# Altium schematic sheet Sheet_EPM7064SLC44.SCHDOC
size A4
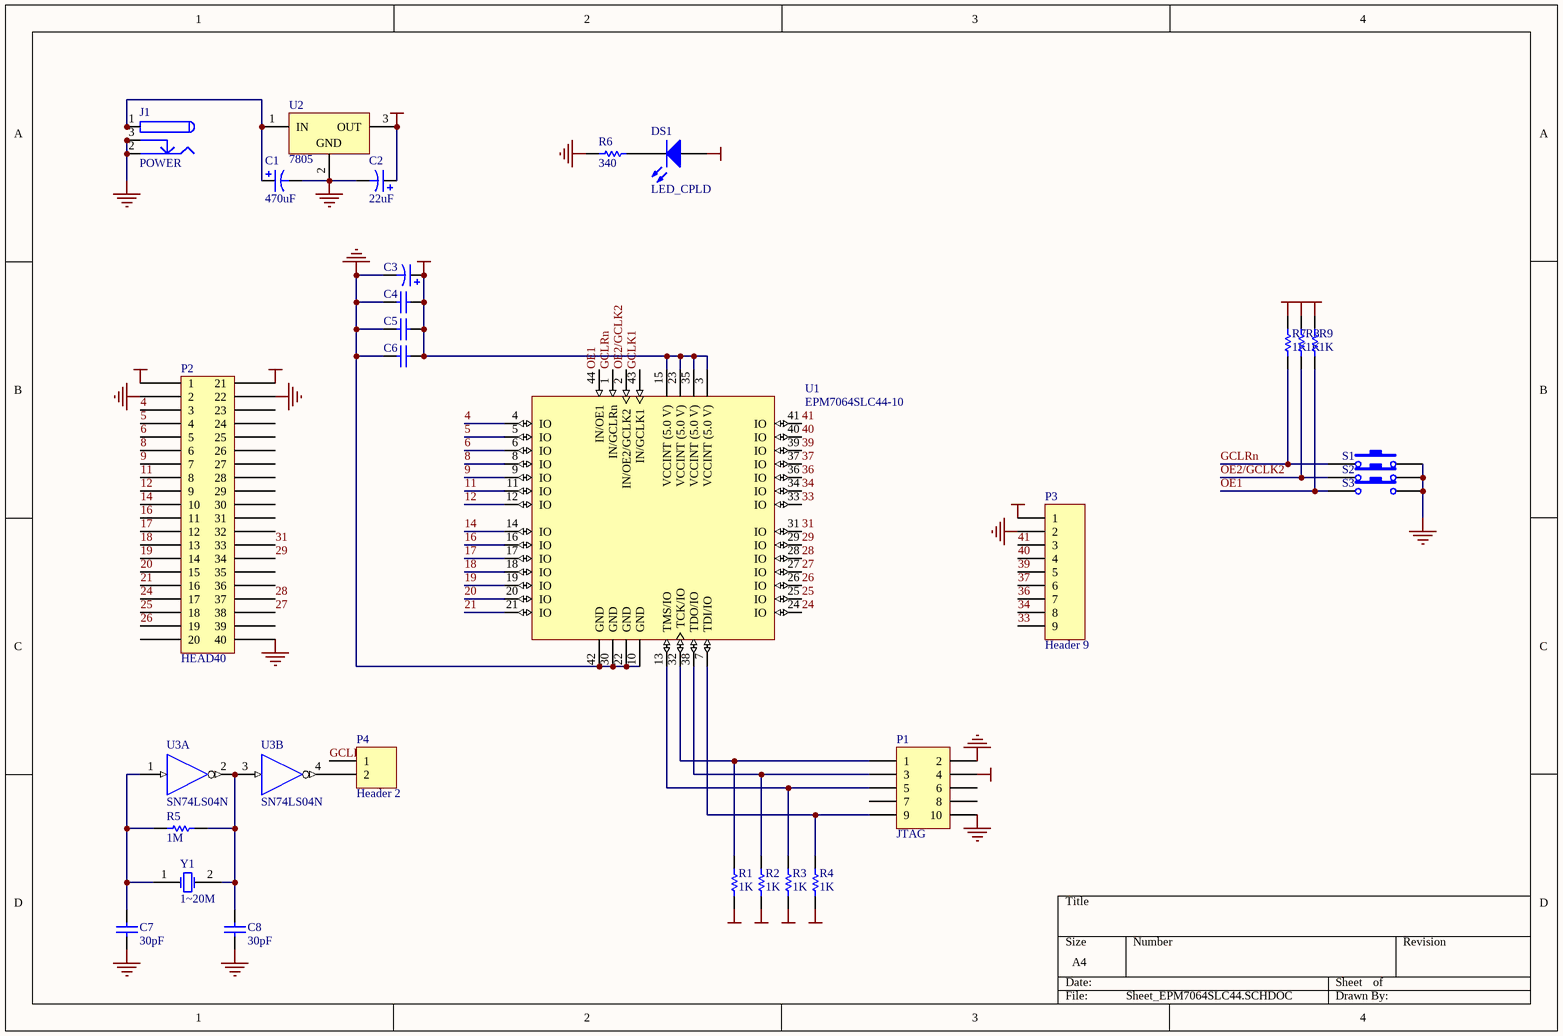
[diagram p0: Sheet_EPM7064SLC44.SCHDOC]

## Parts
C1  470uF  [CAPPR2-5x6.8]
C2  22uF  [CAPPR1.5-4x5]
C3  10uF  [CAPPR1.5-4x5]  (value not drawn)
C4  0.1uF  [CAPR2.54-5.1x3.2]  (value not drawn)
C5  0.1uF  [CAPR2.54-5.1x3.2]  (value not drawn)
C6  0.1uF  [CAPR2.54-5.1x3.2]  (value not drawn)
C7  30pF  [CAPR2.54-5.1x3.2]
C8  30pF  [CAPR2.54-5.1x3.2]
DS1  LED_CPLD  [LED]
J1  POWER  [KLD-0202]
P1  JTAG  [HEADER-5X2POL]
P2  HEAD40  [DBZ2]
P3  Header 9  [HDR1X9]
P4  Header 2  [HDR1X2]
R1  1K  [AXIAL-0.3]
R2  1K  [AXIAL-0.3]
R3  1K  [AXIAL-0.3]
R4  1K  [AXIAL-0.3]
R5  1M  [AXIAL-0.3]
R6  340  [AXIAL-0.3]
R7  1K  [AXIAL-0.3]
R8  1K  [AXIAL-0.3]
R9  1K  [AXIAL-0.3]
S1  SW-PB  [SPST-2]  (value not drawn)
S2  SW-PB  [SPST-2]  (value not drawn)
S3  SW-PB  [SPST-2]  (value not drawn)
U1  EPM7064SLC44-10  [PLCC_44]
U2  7805  [KC03]
U3  SN74LS04N  [N014]  (parts A,B of 6)
Y1  1~20M  [XT2]

## Nets
GND: C1.2 C2.2 C3.2 C4.1 C5.1 C6.1 C7.1 C8.1 J1.2 J1.2A J1.2B J1.3 J1.3A J1.3B P1.2 P1.10 P2.2 P2.22 P2.40 P3.2 R6.2 S1.2 S2.2 S3.2 U1.10(GND) U1.22(GND) U1.30(GND) U1.42(GND) U2.2(GND) U3.7(GND)
VCC: C2.1 C3.1 C4.2 C5.2 C6.2 DS1.1(A) P1.4 P2.1 P2.21 P3.1 R1.1 R2.1 R3.1 R4.1 R7.2 R8.2 R9.2 U1.3(VCCINT_(5.0_V)) U1.15(VCCINT_(5.0_V)) U1.23(VCCINT_(5.0_V)) U1.35(VCCINT_(5.0_V)) U2.3(OUT) U3.14(VCC)
4: P2.3 U1.4(IO)
5: P2.4 U1.5(IO)
6: P2.5 U1.6(IO)
8: P2.6 U1.8(IO)
9: P2.7 U1.9(IO)
11: P2.8 U1.11(IO)
12: P2.9 U1.12(IO)
14: P2.10 U1.14(IO)
16: P2.11 U1.16(IO)
17: P2.12 U1.17(IO)
18: P2.13 U1.18(IO)
19: P2.14 U1.19(IO)
20: P2.15 U1.20(IO)
21: P2.16 U1.21(IO)
24: P2.17 U1.24(IO)
25: P2.18 U1.25(IO)
26: P2.19 U1.26(IO)
27: P2.38 U1.27(IO)
28: P2.37 U1.28(IO)
29: P2.34 U1.29(IO)
31: P2.33 U1.31(IO)
33: P3.9 U1.33(IO)
34: P3.8 U1.34(IO)
36: P3.7 U1.36(IO)
37: P3.6 U1.37(IO)
39: P3.5 U1.39(IO)
40: P3.4 U1.40(IO)
41: P3.3 U1.41(IO)
GCLK1: P4.1 U1.43(IN/GCLK1)
GCLRn: R7.1 S1.1 U1.1(IN/GCLRn)
OE1: R9.1 S3.1 U1.44(IN/OE1)
OE2/GCLK2: R8.1 S2.1 U1.2(IN/OE2/GCLK2)
NetC1_1: C1.1 J1.1 J1.1A J1.1B U2.1(IN)
NetC7_2: C7.2 R5.1 U3.1(A) Y1.1(OSC1)
NetC8_2: C8.2 R5.2 U3.2(Y) U3.3(A) Y1.2(OSC2)
NetDS1_2: DS1.2(K) R6.1
NetP1_1: P1.1 R1.2 U1.32(TCK/IO)
NetP1_3: P1.3 R2.2 U1.38(TDO/IO)
NetP1_5: P1.5 R3.2 U1.13(TMS/IO)
NetP1_9: P1.9 R4.2 U1.7(TDI/IO)
NetP4_2: P4.2 U3.4(Y)

Not connected (* = marked no-connect by the designer): P1 6 7 8; P2 20 23 24 25 26 27 28 29 30 31 32 35 36 39

## Library data of the parts
C1-C3 = Cap Pol1: Polarized Capacitor (Radial); Published: 8-Jun-2000; LatestRevisionDate: 17-Jul-2002; LatestRevisionNote: Re-released for DXP Platform.; Publisher: Altium Limited
  C1: Value: 470uF
  C2: Value: 22uF
  C3: Value: 10uF
C4-C8 = Cap: Capacitor; Published: 8-Jun-2000; LatestRevisionDate: 17-Jul-2002; LatestRevisionNote: Re-released for DXP Platform.; Publisher: Altium Limited
  C4-C6: Value: 0.1uF
  C7 C8: Value: 30pF
DS1 = LED0: Typical INFRARED GaAs LED; Published: 8-Jun-2000; LatestRevisionDate: 17-Jul-2002; LatestRevisionNote: Re-released for DXP Platform.; Publisher: Altium Limited
J1 = PWR2.5: Low Voltage Power Supply Connector; Published: 17-Dec-2003; DatasheetDocument: 09-May-2002; Publisher: Altium Limited
P1 = Header 5X2: Header, 5-Pin, Dual row; LatestRevisionDate: 17-Jul-2002; LatestRevisionNote: Re-released for DXP Platform.; Publisher: Altium Limited
P3 = Header 9: Header, 9-Pin; LatestRevisionDate: 17-Jul-2002; LatestRevisionNote: Re-released for DXP Platform.; Publisher: Altium Limited
P4 = Header 2: Header, 2-Pin; LatestRevisionDate: 17-Jul-2002; LatestRevisionNote: Re-released for DXP Platform.; Publisher: Altium Limited
R1-R9 = Res1: Resistor; Published: 8-Jun-2000; LatestRevisionDate: 17-Jul-2002; LatestRevisionNote: Re-released for DXP Platform.; Publisher: Altium Limited
  R1-R4 R7-R9: Value: 1K
  R5: Value: 1M
  R6: Value: 340
S1-S3 = SW-PB: Switch; Published: 24-Mar-1999; LatestRevisionDate: 17-Jul-2002; LatestRevisionNote: Re-released for DXP Platform.; Publisher: Altium Limited
U1 = EPM7064SLC44-10: MAX 7000S 5V In-System Programmable CPLD, 64 Macrocells, 44-Pin PLCC, Speed Grade 10, Commercial Grade; PackageDocument: ver11.0, Feb-2003; Published: 24-Nov-2000; LatestRevisionDate: 17-Jul-2002; LatestRevisionNote: Re-released for DXP Platform.; DatasheetDocument: ver6.6, Jun-2003; PackageReference: PLCC44; Publisher: Altium Limited; Code_IPC: PLCC-44
U2 = LM330KC: 3-Terminal Positive Regulator; Note: Pin 2 is electrically connected to tab; Published: 15-Apr-2002; DatasheetDocument: Apr-1988; PackageDocument: Sep-1995; PackageReference: KC03; Publisher: Altium Limited
U3 = SN74LS04N: Hex Inverter; Published: 8-Jun-2000; LatestRevisionDate: 17-Jul-2002; LatestRevisionNote: Re-released for DXP Platform.; DatasheetDocument: Mar-1988; PackageDocument: Oct-1995; PackageReference: N014; Publisher: Altium Limited
Y1 = XTAL: Crystal Oscillator; Published: 8-Jun-2000; LatestRevisionDate: 17-Jul-2002; LatestRevisionNote: Re-released for DXP Platform.; Publisher: Altium Limited